# Altium project YarnControl_Mainboard_v1.0.PrjPCB
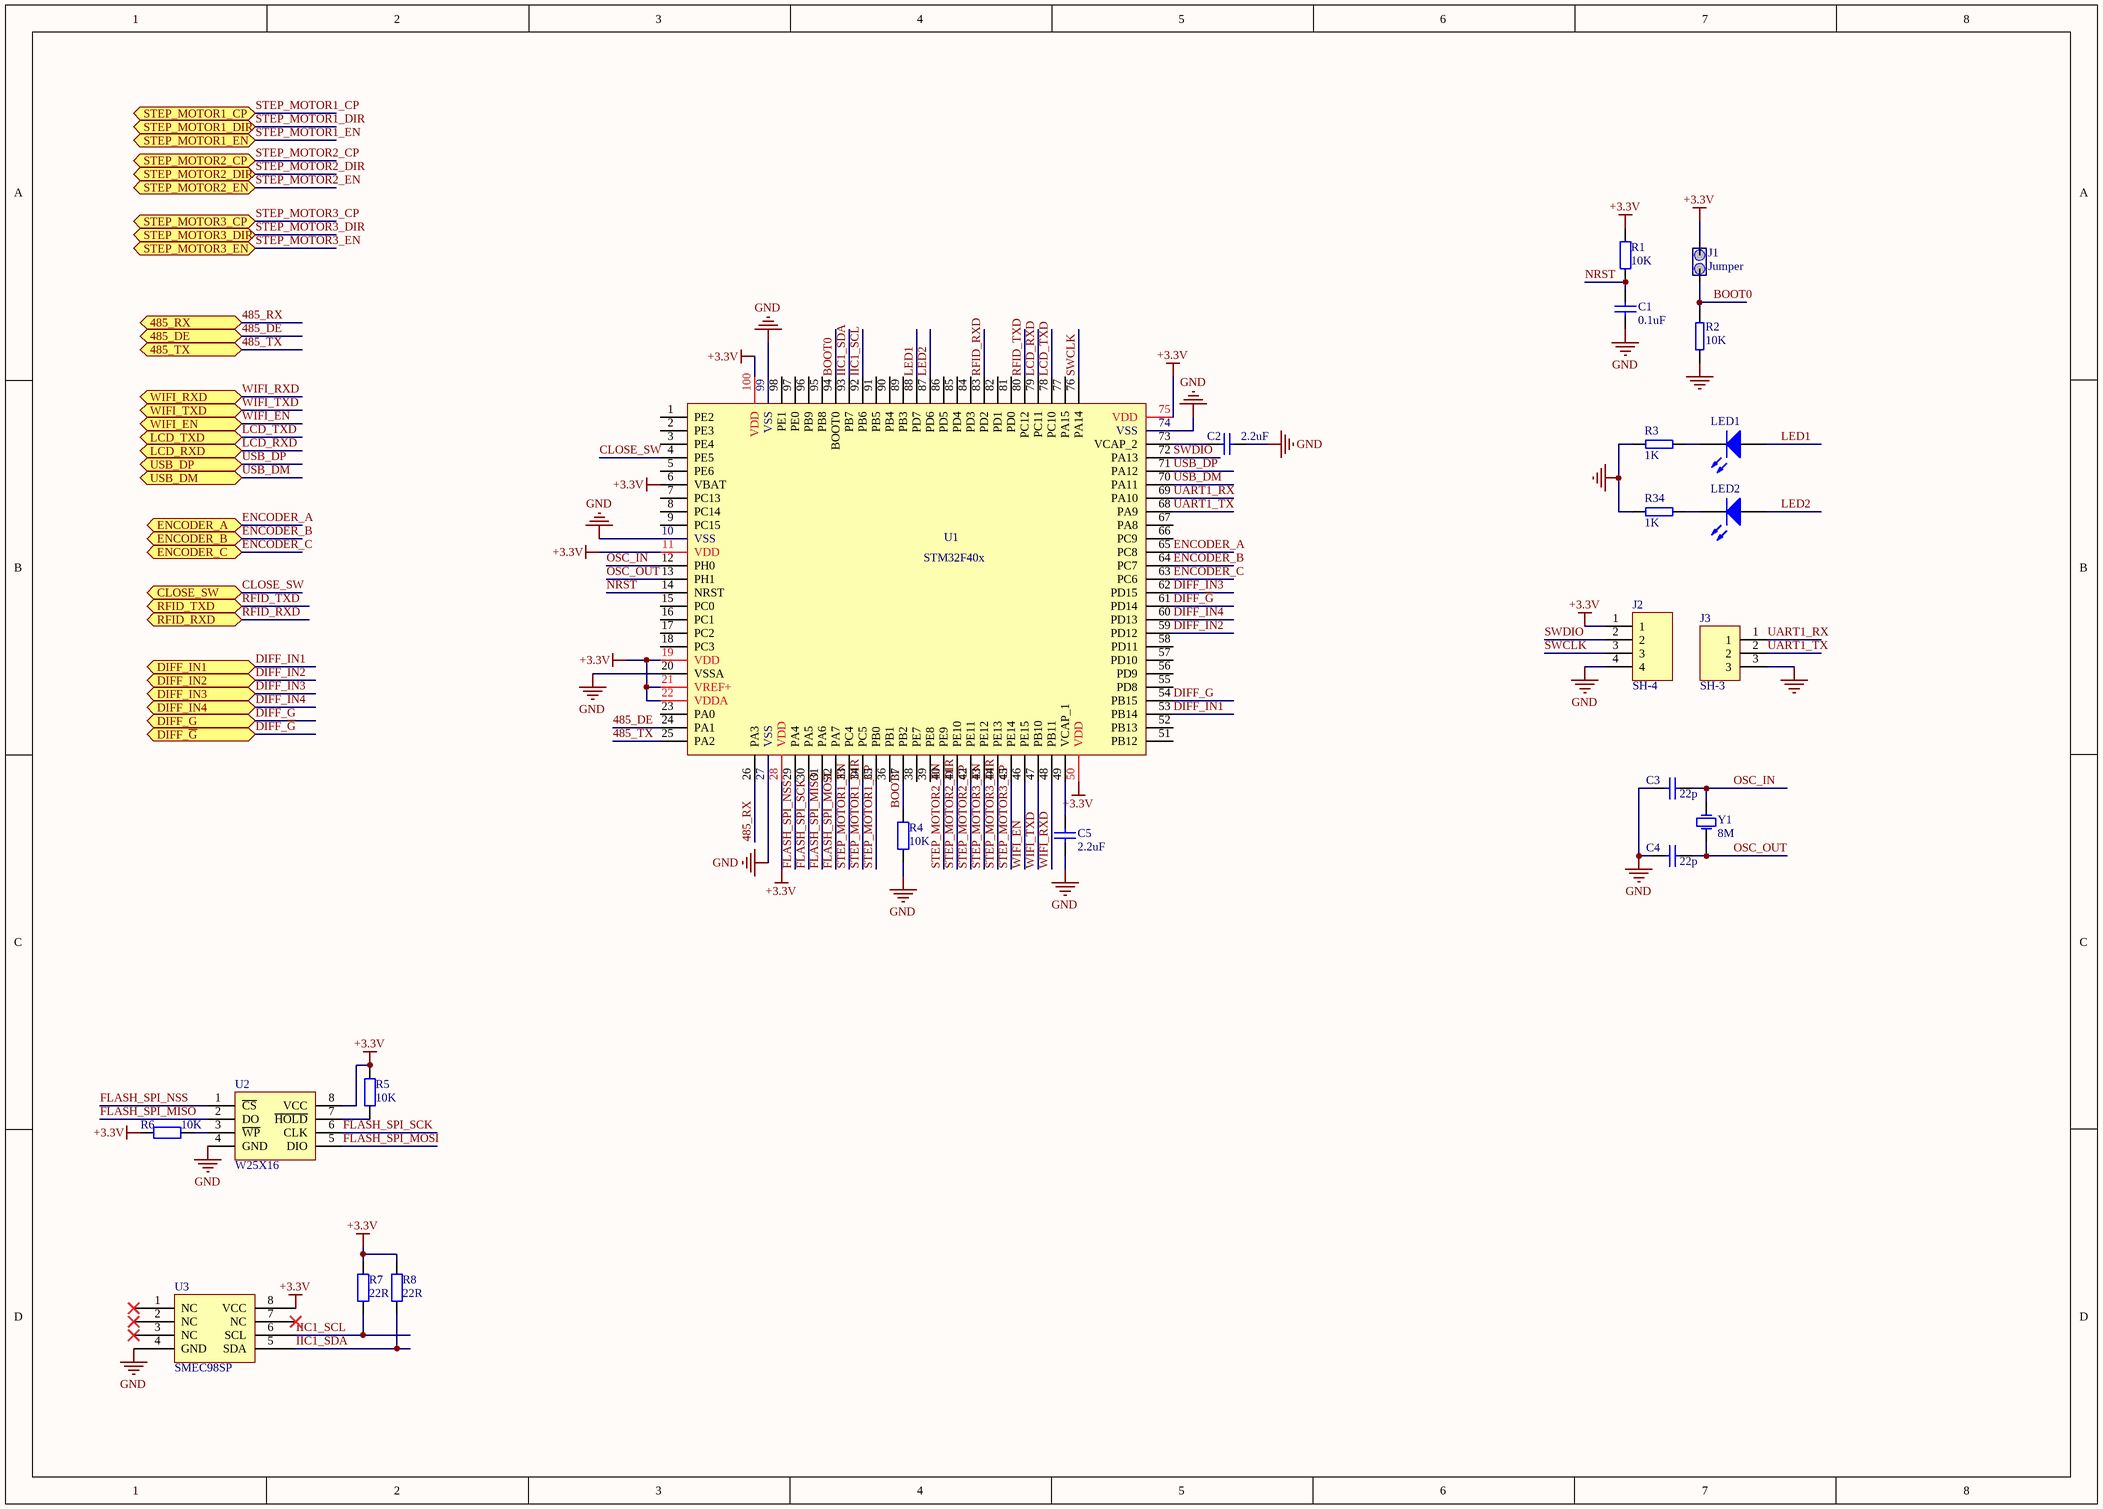
[diagram p0: mainboard_mcu.v1.0.SchDoc]
5 sheets, 119 parts. Net scope: flat (ports and power ports of the same name join across sheets).
Board file: YarnControl_Mainboard_v1.0.PcbDoc
Sheets:
  mainboard_mcu.v1.0.SchDoc
  mainboard_motor.v1.0.SchDoc
  mainboard_rs485.v1.0.SchDoc
  mainboard_wifi.v1.0.SchDoc
  mainboard_interface.v1.0.SchDoc

## Sheet mainboard_mcu.v1.0.SchDoc
size A3

### Parts
C1  0.1uF  [0805]
C2  2.2uF  [0805]
C3  22p  [0805]
C4  22p  [0805]
C5  2.2uF  [0805]
J1  Jumper  [J254-2]
J2  SH-4  [J254-4]
J3  SH-3  [J2.54-3]
LED1  GREEN  [LED]  (value not drawn)
LED2  GREEN  [LED]  (value not drawn)
R1  10K  [0805]
R2  10K  [0805]
R3  1K  [0805]
R4  10K  [0805]
R5  10K  [0805]
R6  10K  [0805]
R7  22R  [0805]
R8  22R  [0805]
R34  1K  [0805]
U1  STM32F40x  [TQFP100]
U2  W25X16  [SOP8]
U3  SMEC98SP  [SO-8]
Y1  8M  [XTAL]

### Ports
485_DE, 485_RX, 485_TX, CLOSE_SW, DIFF_G, DIFF_IN1, DIFF_IN2, DIFF_IN3, DIFF_IN4, DIFF_~{G}, ENCODER_A, ENCODER_B, ENCODER_C, LCD_RXD, LCD_TXD, RFID_RXD, RFID_TXD, STEP_MOTOR1_CP, STEP_MOTOR1_DIR, STEP_MOTOR1_EN, STEP_MOTOR2_CP, STEP_MOTOR2_DIR, STEP_MOTOR2_EN, STEP_MOTOR3_CP, STEP_MOTOR3_DIR, STEP_MOTOR3_EN, USB_DM, USB_DP, WIFI_EN, WIFI_RXD, WIFI_TXD

### Nets
+3.3V: J1.2 J2.1 R1.2 R5.1 R6.2 R7.2 R8.2 U1.6(VBAT) U1.11(VDD) U1.19(VDD) U1.21(VREF+) U1.22(VDDA) U1.28(VDD) U1.50(VDD) U1.75(VDD) U1.100(VDD) U2.8(VCC) U3.8(VCC)
GND: C1.1 C2.1 C3.2 C4.2 C5.2 J2.4 J3.3 R2.2 R3.2 R4.2 R34.2 U1.10(VSS) U1.20(VSSA) U1.27(VSS) U1.74(VSS) U1.99(VSS) U2.4(GND) U3.4(GND)
485_DE: U1.24(PA1) ; port 485_DE
485_RX: U1.26(PA3) ; port 485_RX
485_TX: U1.25(PA2) ; port 485_TX
BOOT0: J1.1 R2.1 U1.94(BOOT0)
BOOT1: R4.1 U1.37(PB2)
CLOSE_SW: U1.4(PE5) ; port CLOSE_SW
DIFF_G: U1.54(PB15) ; port DIFF_G
DIFF_~{G}: U1.61(PD14) ; port DIFF_~{G}
DIFF_IN1: U1.53(PB14) ; port DIFF_IN1
DIFF_IN2: U1.59(PD12) ; port DIFF_IN2
DIFF_IN3: U1.62(PD15) ; port DIFF_IN3
DIFF_IN4: U1.60(PD13) ; port DIFF_IN4
ENCODER_A: U1.65(PC8) ; port ENCODER_A
ENCODER_B: U1.64(PC7) ; port ENCODER_B
ENCODER_C: U1.63(PC6) ; port ENCODER_C
FLASH_SPI_MISO: U1.31(PA6) U2.2(DO)
FLASH_SPI_MOSI: U1.32(PA7) U2.5(DIO)
FLASH_SPI_NSS: U1.29(PA4) U2.1(~{CS})
FLASH_SPI_SCK: U1.30(PA5) U2.6(CLK)
IIC1_SCL: R7.1 U1.92(PB6) U3.6(SCL)
IIC1_SDA: R8.1 U1.93(PB7) U3.5(SDA)
LCD_RXD: U1.79(PC11) ; port LCD_RXD
LCD_TXD: U1.78(PC10) ; port LCD_TXD
LED1: LED1.1(A) U1.88(PD7)
LED2: LED2.1(A) U1.87(PD6)
NRST: C1.2 R1.1 U1.14(NRST)
OSC_IN: C3.1 U1.12(PH0) Y1.2(OSC2)
OSC_OUT: C4.1 U1.13(PH1) Y1.1(OSC1)
RFID_RXD: U1.83(PD2) ; port RFID_RXD
RFID_TXD: U1.80(PC12) ; port RFID_TXD
STEP_MOTOR1_CP: U1.35(PB0) ; port STEP_MOTOR1_CP
STEP_MOTOR1_DIR: U1.34(PC5) ; port STEP_MOTOR1_DIR
STEP_MOTOR1_EN: U1.33(PC4) ; port STEP_MOTOR1_EN
STEP_MOTOR2_CP: U1.42(PE11) ; port STEP_MOTOR2_CP
STEP_MOTOR2_DIR: U1.41(PE10) ; port STEP_MOTOR2_DIR
STEP_MOTOR2_EN: U1.40(PE9) ; port STEP_MOTOR2_EN
STEP_MOTOR3_CP: U1.45(PE14) ; port STEP_MOTOR3_CP
STEP_MOTOR3_DIR: U1.44(PE13) ; port STEP_MOTOR3_DIR
STEP_MOTOR3_EN: U1.43(PE12) ; port STEP_MOTOR3_EN
SWCLK: J2.3 U1.76(PA14)
SWDIO: J2.2 U1.72(PA13)
UART1_RX: J3.1 U1.69(PA10)
UART1_TX: J3.2 U1.68(PA9)
USB_DM: U1.70(PA11) ; port USB_DM
USB_DP: U1.71(PA12) ; port USB_DP
WIFI_EN: U1.46(PE15) ; port WIFI_EN
WIFI_RXD: U1.48(PB11) ; port WIFI_RXD
WIFI_TXD: U1.47(PB10) ; port WIFI_TXD
NetC2_2: C2.2 U1.73(VCAP_2)
NetC5_1: C5.1 U1.49(VCAP_1)
NetLED1_2: LED1.2(K) R3.1
NetLED2_2: LED2.2(K) R34.1
NetR5_2: R5.2 U2.7(~{HOLD})
NetR6_1: R6.1 U2.3(~{WP})

Not connected (* = marked no-connect by the designer): U1 1(PE2) 2(PE3) 3(PE4) 5(PE6) 7(PC13) 8(PC14) 9(PC15) 15(PC0) 16(PC1) 17(PC2) 18(PC3) 23(PA0) 36(PB1) 38(PE7) 39(PE8) 51(PB12) 52(PB13) 55(PD8) 56(PD9) 57(PD10) 58(PD11) 66(PC9) 67(PA8) 77(PA15) 81(PD0) 82(PD1) 84(PD3) 85(PD4) 86(PD5) 89(PB3) 90(PB4) 91(PB5) 95(PB8) 96(PB9) 97(PE0) 98(PE1); U3 1(NC)* 2(NC)* 3(NC)* 7(NC)*

### Library data of the parts
C1-C5 = Cap: Capacitor; Value: 100pF; Published: 8-Jun-2000; LatestRevisionDate: 17-Jul-2002; LatestRevisionNote: Re-released for DXP Platform.; PackageReference: RAD-0.3; Publisher: Altium Limited
LED1 LED2 = LED2: Typical RED, GREEN, YELLOW, AMBER GaAs LED; Published: 8-Jun-2000; Revision: July-2002: Re-released for DXP Platform.; Publisher: Altium Limited
R1 R4-R8 = Res2: Resistor; Value: 1K; Published: 8-Jun-2000; LatestRevisionDate: 17-Jul-2002; LatestRevisionNote: Re-released for DXP Platform.; PackageReference: AXIAL-0.4; Publisher: Altium Limited
R2 R3 R34 = RES: 电阻
Y1 = X-32.768: Crystal Oscillator; Published: 8-Jun-2000; LatestRevisionDate: 17-Jul-2002; LatestRevisionNote: Re-released for DXP Platform.; PackageReference: R38; Publisher: Altium Limited

## Sheet mainboard_motor.v1.0.SchDoc
size A4
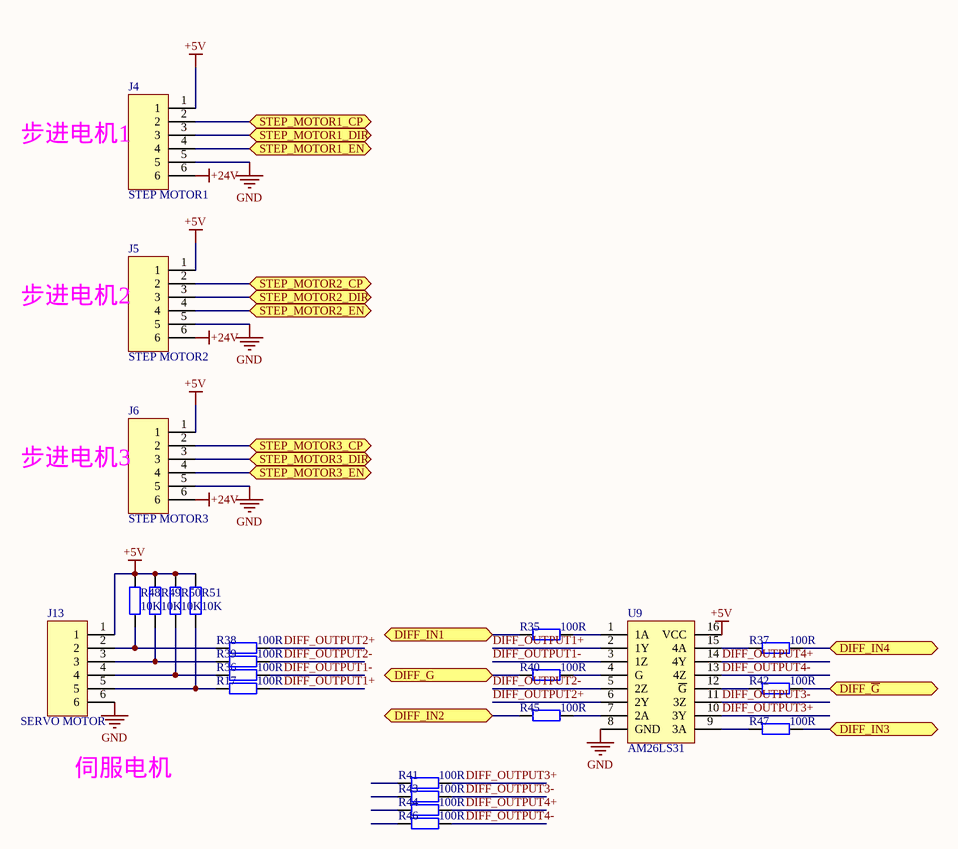
[diagram p1: mainboard_motor.v1.0.SchDoc]

### Parts
J4  STEP MOTOR1  [XH2.54-6T]
J5  STEP MOTOR2  [XH2.54-6T]
J6  STEP MOTOR3  [XH2.54-6T]
J13  SERVO MOTOR  [XH2.54-6T]
R17  100R  [0805]
R35  100R  [0805]
R36  100R  [0805]
R37  100R  [0805]
R38  100R  [0805]
R39  100R  [0805]
R40  100R  [0805]
R41  100R  [0805]
R42  100R  [0805]
R43  100R  [0805]
R44  100R  [0805]
R45  100R  [0805]
R46  100R  [0805]
R47  100R  [0805]
R48  10K  [0805]
R49  10K  [0805]
R50  10K  [0805]
R51  10K  [0805]
U9  AM26LS31  [SO-16]

### Ports
DIFF_G, DIFF_IN1, DIFF_IN2, DIFF_IN3, DIFF_IN4, DIFF_~{G}, STEP_MOTOR1_CP, STEP_MOTOR1_DIR, STEP_MOTOR1_EN, STEP_MOTOR2_CP, STEP_MOTOR2_DIR, STEP_MOTOR2_EN, STEP_MOTOR3_CP, STEP_MOTOR3_DIR, STEP_MOTOR3_EN

### Nets
+5V: J4.1 J5.1 J6.1 J13.1 R48.1 R49.1 R50.1 R51.1 U9.16(VCC)
+24V: J4.6 J5.6 J6.6
GND: J4.5 J5.5 J6.5 J13.6 U9.8(GND)
DIFF_G: R40.2 ; port DIFF_G
DIFF_~{G}: R42.1 ; port DIFF_~{G}
DIFF_IN1: R35.2 ; port DIFF_IN1
DIFF_IN2: R45.2 ; port DIFF_IN2
DIFF_IN3: R47.1 ; port DIFF_IN3
DIFF_IN4: R37.1 ; port DIFF_IN4
DIFF_OUTPUT1+: R17.1 U9.2(1Y)
DIFF_OUTPUT1-: R36.1 U9.3(1Z)
DIFF_OUTPUT2+: R38.1 U9.6(2Y)
DIFF_OUTPUT2-: R39.1 U9.5(2Z)
DIFF_OUTPUT3+: R41.1 U9.10(3Y)
DIFF_OUTPUT3-: R43.1 U9.11(3Z)
DIFF_OUTPUT4+: R44.1 U9.14(4Y)
DIFF_OUTPUT4-: R46.1 U9.13(4Z)
STEP_MOTOR1_CP: J4.2 ; port STEP_MOTOR1_CP
STEP_MOTOR1_DIR: J4.3 ; port STEP_MOTOR1_DIR
STEP_MOTOR1_EN: J4.4 ; port STEP_MOTOR1_EN
STEP_MOTOR2_CP: J5.2 ; port STEP_MOTOR2_CP
STEP_MOTOR2_DIR: J5.3 ; port STEP_MOTOR2_DIR
STEP_MOTOR2_EN: J5.4 ; port STEP_MOTOR2_EN
STEP_MOTOR3_CP: J6.2 ; port STEP_MOTOR3_CP
STEP_MOTOR3_DIR: J6.3 ; port STEP_MOTOR3_DIR
STEP_MOTOR3_EN: J6.4 ; port STEP_MOTOR3_EN
NetJ13_2: J13.2 R38.2 R48.2
NetJ13_3: J13.3 R39.2 R49.2
NetJ13_4: J13.4 R36.2 R50.2
NetJ13_5: J13.5 R17.2 R51.2
NetR35_1: R35.1 U9.1(1A)
NetR37_2: R37.2 U9.15(4A)
NetR40_1: R40.1 U9.4(G)
NetR42_2: R42.2 U9.12(~{G})
NetR45_1: R45.1 U9.7(2A)
NetR47_2: R47.2 U9.9(3A)

Not connected (* = marked no-connect by the designer): R41 2; R43 2; R44 2; R46 2

### Notes on the sheet
- 步进电机1
- 步进电机2
- 步进电机3
- 伺服电机

### Library data of the parts
J4-J6 J13 = SH-6
R17 R35-R51 = Res2: Resistor; Value: 1K; Published: 8-Jun-2000; LatestRevisionDate: 17-Jul-2002; LatestRevisionNote: Re-released for DXP Platform.; PackageReference: AXIAL-0.4; Publisher: Altium Limited

## Sheet mainboard_rs485.v1.0.SchDoc
size A4
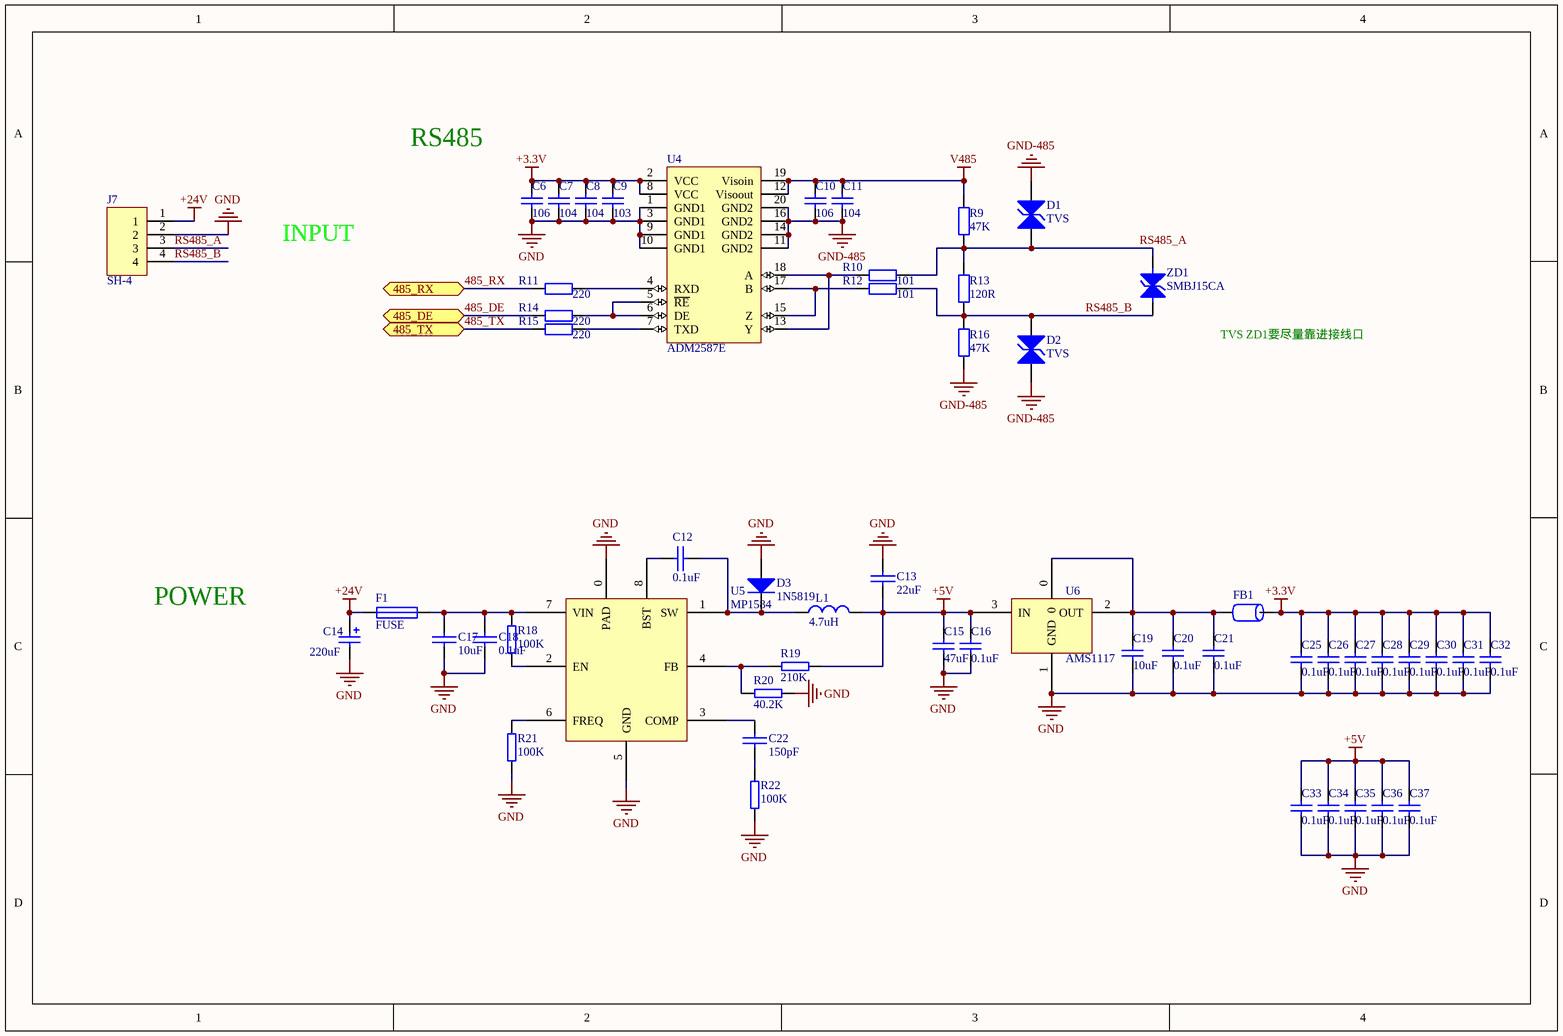
[diagram p2: mainboard_rs485.v1.0.SchDoc]

### Parts
C6  106  [0805]
C7  104  [0805]
C8  104  [0805]
C9  103  [0805]
C10  106  [0805]
C11  104  [0805]
C12  0.1uF  [0805]
C13  22uF  [0805]
C14  220uF  [CAP-5mm]
C15  47uF  [1812]
C16  0.1uF  [0805]
C17  10uF  [0805]
C18  0.1uF  [0805]
C19  10uF  [0805]
C20  0.1uF  [0805]
C21  0.1uF  [0805]
C22  150pF  [0805]
C25  0.1uF  [0805]
C26  0.1uF  [0805]
C27  0.1uF  [0805]
C28  0.1uF  [0805]
C29  0.1uF  [0805]
C30  0.1uF  [0805]
C31  0.1uF  [0805]
C32  0.1uF  [0805]
C33  0.1uF  [0805]
C34  0.1uF  [0805]
C35  0.1uF  [0805]
C36  0.1uF  [0805]
C37  0.1uF  [0805]
D1  TVS  [SMBJ_DO-214]
D2  TVS  [SMBJ_DO-214]
D3  1N5819  [Diode_TP2]
F1  FUSE  [1206]
FB1  FERRITE  [0805]  (value not drawn)
J7  SH-4  [J5.08_4(NoEar)]
L1  4.7uH  [Inductance6*6]
R9  47K  [0805]
R10  101  [0805]
R11  220  [0805]
R12  101  [0805]
R13  120R  [0805]
R14  220  [0805]
R15  220  [0805]
R16  47K  [0805]
R18  100K  [0805]
R19  210K  [0805]
R20  40.2K  [0805]
R21  100K  [0805]
R22  100K  [0805]
U4  ADM2587E  [SOIC_W_20]
U5  MP1584  [MP1584]
U6  AMS1117  [TO-223]
ZD1  SMBJ15CA  [DO-214AA/SMB]

### Ports
485_DE, 485_RX, 485_TX

### Nets
+3.3V: C6.2 C7.2 C8.2 C9.2 C25.2 C26.2 C27.2 C28.2 C29.2 C30.2 C31.2 C32.2 FB1.2 U4.2(VCC) U4.8(VCC)
+5V: C13.2 C15.2 C16.2 C33.2 C34.2 C35.2 C36.2 C37.2 L1.2 R19.1 U6.3(IN)
+24V: C14.1 F1.1 J7.1
GND: C6.1 C7.1 C8.1 C9.1 C13.1 C14.2 C15.1 C16.1 C17.2 C18.2 C19.1 C20.1 C21.1 C25.1 C26.1 C27.1 C28.1 C29.1 C30.1 C31.1 C32.1 C33.1 C34.1 C35.1 C36.1 C37.1 D3.1(A) J7.2 R20.1 R21.1 R22.1 U4.1(GND1) U4.3(GND1) U4.9(GND1) U4.10(GND1) U5.0(PAD) U5.5(GND) U6.1(GND)
GND-485: C10.1 C11.1 D1.1(A) D2.1(A) R16.1 U4.11(GND2) U4.14(GND2) U4.16(GND2) U4.20(GND2)
V485: C10.2 C11.2 R9.2 U4.12(Visoout) U4.19(Visoin)
485_DE: R14.1 ; port 485_DE
485_RX: R11.1 ; port 485_RX
485_TX: R15.1 ; port 485_TX
RS485_A: D1.2(K) J7.3 R9.1 R10.2 R13.2 ZD1.1
RS485_B: D2.2(K) J7.4 R12.2 R13.1 R16.2 ZD1.2
NetC12_1: C12.1 U5.8(BST)
NetC12_2: C12.2 D3.2(K) L1.1 U5.1(SW)
NetC17_1: C17.1 C18.1 F1.2 R18.2 U5.7(VIN)
NetC19_2: C19.2 C20.2 C21.2 FB1.1 U6.0 U6.2(OUT)
NetC22_1: C22.1 U5.3(COMP)
NetC22_2: C22.2 R22.2
NetR10_1: R10.1 U4.13(Y) U4.18(A)
NetR11_2: R11.2 U4.4(RXD)
NetR12_1: R12.1 U4.15(Z) U4.17(B)
NetR14_2: R14.2 U4.5(~{RE}) U4.6(DE)
NetR15_2: R15.2 U4.7(TXD)
NetR18_1: R18.1 U5.2(EN)
NetR19_2: R19.2 R20.2 U5.4(FB)
NetR21_2: R21.2 U5.6(FREQ)

### Notes on the sheet
- RS485
- INPUT
- (near ZD1) TVS ZD1要尽量靠进接线口
- POWER

### Library data of the parts
C6-C11 = Cap: Capacitor; Value: 100pF; Published: 8-Jun-2000; LatestRevisionDate: 17-Jul-2002; LatestRevisionNote: Re-released for DXP Platform.; PackageReference: RAD-0.3; Publisher: Altium Limited
C12 C13 C17 C18 C22 = CAP: 电容
C14 = Cap Pol1: 电解电容
C15 C16 C19-C21 C25-C37 = Cap0805
D3 = Diode: 二极管; Published: 8-Jun-2000; LatestRevisionDate: 17-Jul-2002; LatestRevisionNote: Re-released for DXP Platform.; PackageVersion: Sep-1996; PackageReference: SMC; Publisher: Altium Limited; PackageDescription: DO-214-AB/SMC; 2 C-Bend Leads; Body 7.9 x 5.9 mm, inc. leads (LxW); Code_JEDEC: DO-214-AB
F1 = FUSE: 保险丝
L1 = Inductor: 电感
R9-R16 = Res2: Resistor; Value: 1K; Published: 8-Jun-2000; LatestRevisionDate: 17-Jul-2002; LatestRevisionNote: Re-released for DXP Platform.; PackageReference: AXIAL-0.4; Publisher: Altium Limited
R18-R22 = RES: 电阻
U4 = ADM2587E: isolated DC-DC RS485
ZD1 = TVS: 瞬态抑制二极管
D1 D2 = TVS: Published: 8-Jun-2000; LatestRevisionDate: 17-Jul-2002; LatestRevisionNote: Re-released for DXP Platform.; PackageReference: DIODE-0.7; Publisher: Altium Limited

## Sheet mainboard_wifi.v1.0.SchDoc
size A4
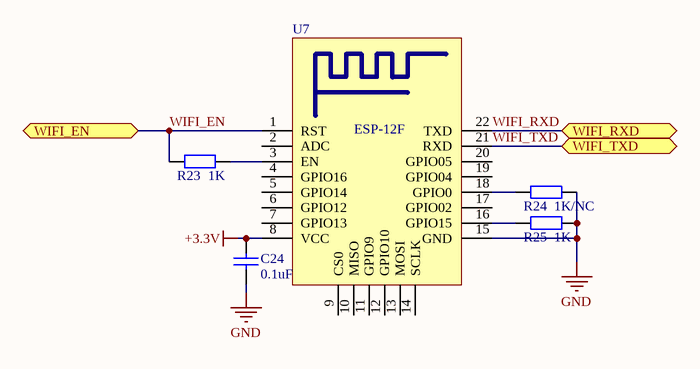
[diagram p3: mainboard_wifi.v1.0.SchDoc]

### Parts
C24  0.1uF  [0805]
R23  1K  [0805]
R24  1K/NC  [0805]
R25  1K  [0805]
U7  ESP-12F  [ESP-12F]

### Ports
WIFI_EN, WIFI_RXD, WIFI_TXD

### Nets
+3.3V: C24.2 U7.8(VCC)
GND: C24.1 R24.2 R25.2 U7.15(GND)
WIFI_EN: R23.1 U7.1(RST) ; port WIFI_EN
WIFI_RXD: U7.22(TXD) ; port WIFI_RXD
WIFI_TXD: U7.21(RXD) ; port WIFI_TXD
NetR23_2: R23.2 U7.3(EN)
NetR24_1: R24.1 U7.18(GPIO0)
NetR25_1: R25.1 U7.16(GPIO15)

Not connected (* = marked no-connect by the designer): U7 2(ADC) 4(GPIO16) 5(GPIO14) 6(GPIO12) 7(GPIO13) 9(CS0) 10(MISO) 11(GPIO9) 12(GPIO10) 13(MOSI) 14(SCLK) 17(GPIO02) 19(GPIO04) 20(GPIO05)

### Library data of the parts
C24 = Cap: Capacitor
R23-R25 = Res2: Resistor

## Sheet mainboard_interface.v1.0.SchDoc
size A4
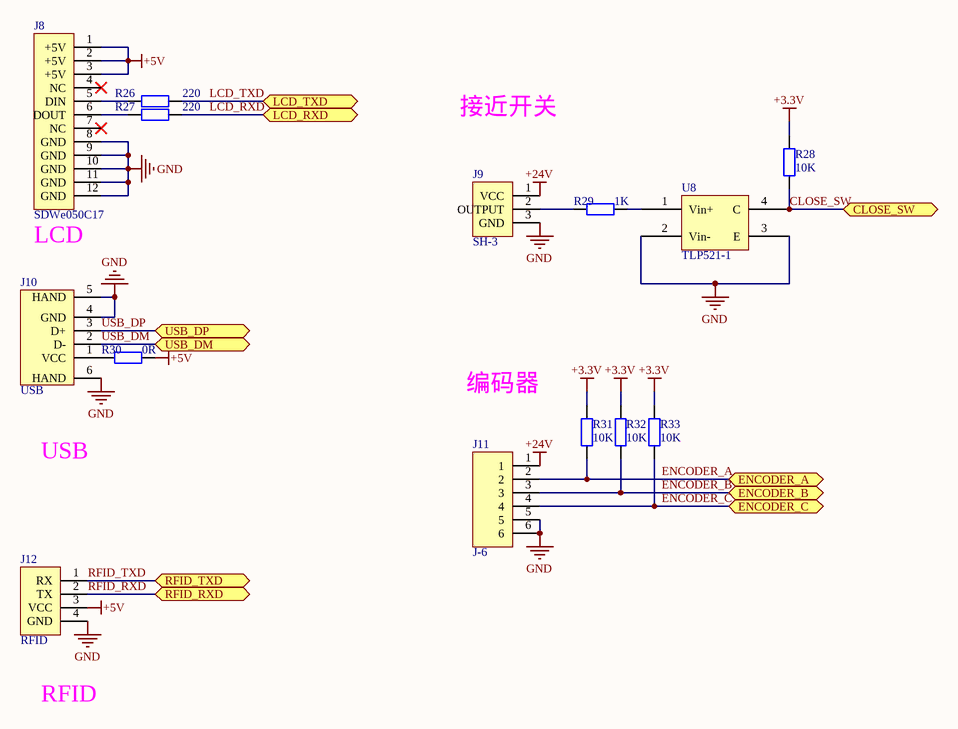
[diagram p4: mainboard_interface.v1.0.SchDoc]

### Parts
J8  SDWe050C17  [FCC1.0-10]
J9  SH-3  [PH2.0-3T]
J10  USB  [USB_FEMALE_A]
J11  J-6  [PH2.0-6P]
J12  RFID  [J254-4]
R26  220  [0805]
R27  220  [0805]
R28  10K  [0805]
R29  1K  [0805]
R30  0R  [0805]
R31  10K  [0805]
R32  10K  [0805]
R33  10K  [0805]
U8  TLP521-1  [DIP-4]

### Ports
CLOSE_SW, ENCODER_A, ENCODER_B, ENCODER_C, LCD_RXD, LCD_TXD, RFID_RXD, RFID_TXD, USB_DM, USB_DP

### Nets
+3.3V: R28.1 R31.1 R32.1 R33.1
+5V: J8.1(+5V) J8.2(+5V) J8.3(+5V) J12.3(VCC) R30.1
+24V: J9.1(VCC) J11.1
GND: J8.8(GND) J8.9(GND) J8.10(GND) J8.11(GND) J8.12(GND) J9.3(GND) J10.4(GND) J10.5(HAND) J10.6(HAND) J11.5 J11.6 J12.4(GND) U8.2(Vin-) U8.3(E)
CLOSE_SW: R28.2 U8.4(C) ; port CLOSE_SW
ENCODER_A: J11.2 R31.2 ; port ENCODER_A
ENCODER_B: J11.3 R32.2 ; port ENCODER_B
ENCODER_C: J11.4 R33.2 ; port ENCODER_C
LCD_RXD: R27.2 ; port LCD_RXD
LCD_TXD: R26.2 ; port LCD_TXD
RFID_RXD: J12.2(TX) ; port RFID_RXD
RFID_TXD: J12.1(RX) ; port RFID_TXD
USB_DM: J10.2(D-) ; port USB_DM
USB_DP: J10.3(D+) ; port USB_DP
NetJ8_5: J8.5(DIN) R26.1
NetJ8_6: J8.6(DOUT) R27.1
NetJ9_2: J9.2(OUTPUT) R29.2
NetJ10_1: J10.1(VCC) R30.2
NetR29_1: R29.1 U8.1(Vin+)

Not connected (* = marked no-connect by the designer): J8 4(NC)* 7(NC)*

### Notes on the sheet
- 接近开关
- (near J8) LCD
- 编码器
- USB
- RFID

### Library data of the parts
J8 = SH-12
J11 = SH-6
J12 = SH-4
R26-R28 R30-R33 = Res2: Resistor; Value: 1K; Published: 8-Jun-2000; LatestRevisionDate: 17-Jul-2002; LatestRevisionNote: Re-released for DXP Platform.; PackageReference: AXIAL-0.4; Publisher: Altium Limited
R29 = Res2: Resistor; Published: 8-Jun-2000; LatestRevisionDate: 17-Jul-2002; LatestRevisionNote: Re-released for DXP Platform.; PackageReference: AXIAL-0.4; Publisher: Altium Limited; Value: 1K

## Nets that join several sheets
+3.3V: mainboard_mcu.v1.0 (18 pins), mainboard_rs485.v1.0 (15 pins), mainboard_wifi.v1.0 (C24.2 U7.8), mainboard_interface.v1.0 (R28.1 R31.1 R32.1 R33.1)
+5V: mainboard_motor.v1.0 (9 pins), mainboard_rs485.v1.0 (11 pins), mainboard_interface.v1.0 (5 pins)
+24V: mainboard_motor.v1.0 (J4.6 J5.6 J6.6), mainboard_rs485.v1.0 (C14.1 F1.1 J7.1), mainboard_interface.v1.0 (J9.1 J11.1)
GND: mainboard_mcu.v1.0 (18 pins), mainboard_motor.v1.0 (5 pins), mainboard_rs485.v1.0 (38 pins), mainboard_wifi.v1.0 (C24.1 R24.2 R25.2 U7.15), mainboard_interface.v1.0 (14 pins)
485_DE: mainboard_mcu.v1.0 (U1.24), mainboard_rs485.v1.0 (R14.1)
485_RX: mainboard_mcu.v1.0 (U1.26), mainboard_rs485.v1.0 (R11.1)
485_TX: mainboard_mcu.v1.0 (U1.25), mainboard_rs485.v1.0 (R15.1)
CLOSE_SW: mainboard_mcu.v1.0 (U1.4), mainboard_interface.v1.0 (R28.2 U8.4)
DIFF_G: mainboard_mcu.v1.0 (U1.54), mainboard_motor.v1.0 (R40.2)
DIFF_~{G}: mainboard_mcu.v1.0 (U1.61), mainboard_motor.v1.0 (R42.1)
DIFF_IN1: mainboard_mcu.v1.0 (U1.53), mainboard_motor.v1.0 (R35.2)
DIFF_IN2: mainboard_mcu.v1.0 (U1.59), mainboard_motor.v1.0 (R45.2)
DIFF_IN3: mainboard_mcu.v1.0 (U1.62), mainboard_motor.v1.0 (R47.1)
DIFF_IN4: mainboard_mcu.v1.0 (U1.60), mainboard_motor.v1.0 (R37.1)
ENCODER_A: mainboard_mcu.v1.0 (U1.65), mainboard_interface.v1.0 (J11.2 R31.2)
ENCODER_B: mainboard_mcu.v1.0 (U1.64), mainboard_interface.v1.0 (J11.3 R32.2)
ENCODER_C: mainboard_mcu.v1.0 (U1.63), mainboard_interface.v1.0 (J11.4 R33.2)
LCD_RXD: mainboard_mcu.v1.0 (U1.79), mainboard_interface.v1.0 (R27.2)
LCD_TXD: mainboard_mcu.v1.0 (U1.78), mainboard_interface.v1.0 (R26.2)
RFID_RXD: mainboard_mcu.v1.0 (U1.83), mainboard_interface.v1.0 (J12.2)
RFID_TXD: mainboard_mcu.v1.0 (U1.80), mainboard_interface.v1.0 (J12.1)
STEP_MOTOR1_CP: mainboard_mcu.v1.0 (U1.35), mainboard_motor.v1.0 (J4.2)
STEP_MOTOR1_DIR: mainboard_mcu.v1.0 (U1.34), mainboard_motor.v1.0 (J4.3)
STEP_MOTOR1_EN: mainboard_mcu.v1.0 (U1.33), mainboard_motor.v1.0 (J4.4)
STEP_MOTOR2_CP: mainboard_mcu.v1.0 (U1.42), mainboard_motor.v1.0 (J5.2)
STEP_MOTOR2_DIR: mainboard_mcu.v1.0 (U1.41), mainboard_motor.v1.0 (J5.3)
STEP_MOTOR2_EN: mainboard_mcu.v1.0 (U1.40), mainboard_motor.v1.0 (J5.4)
STEP_MOTOR3_CP: mainboard_mcu.v1.0 (U1.45), mainboard_motor.v1.0 (J6.2)
STEP_MOTOR3_DIR: mainboard_mcu.v1.0 (U1.44), mainboard_motor.v1.0 (J6.3)
STEP_MOTOR3_EN: mainboard_mcu.v1.0 (U1.43), mainboard_motor.v1.0 (J6.4)
USB_DM: mainboard_mcu.v1.0 (U1.70), mainboard_interface.v1.0 (J10.2)
USB_DP: mainboard_mcu.v1.0 (U1.71), mainboard_interface.v1.0 (J10.3)
WIFI_EN: mainboard_mcu.v1.0 (U1.46), mainboard_wifi.v1.0 (R23.1 U7.1)
WIFI_RXD: mainboard_mcu.v1.0 (U1.48), mainboard_wifi.v1.0 (U7.22)
WIFI_TXD: mainboard_mcu.v1.0 (U1.47), mainboard_wifi.v1.0 (U7.21)